# EAGLE schematic uC_Board (EAGLE 7.1.0)
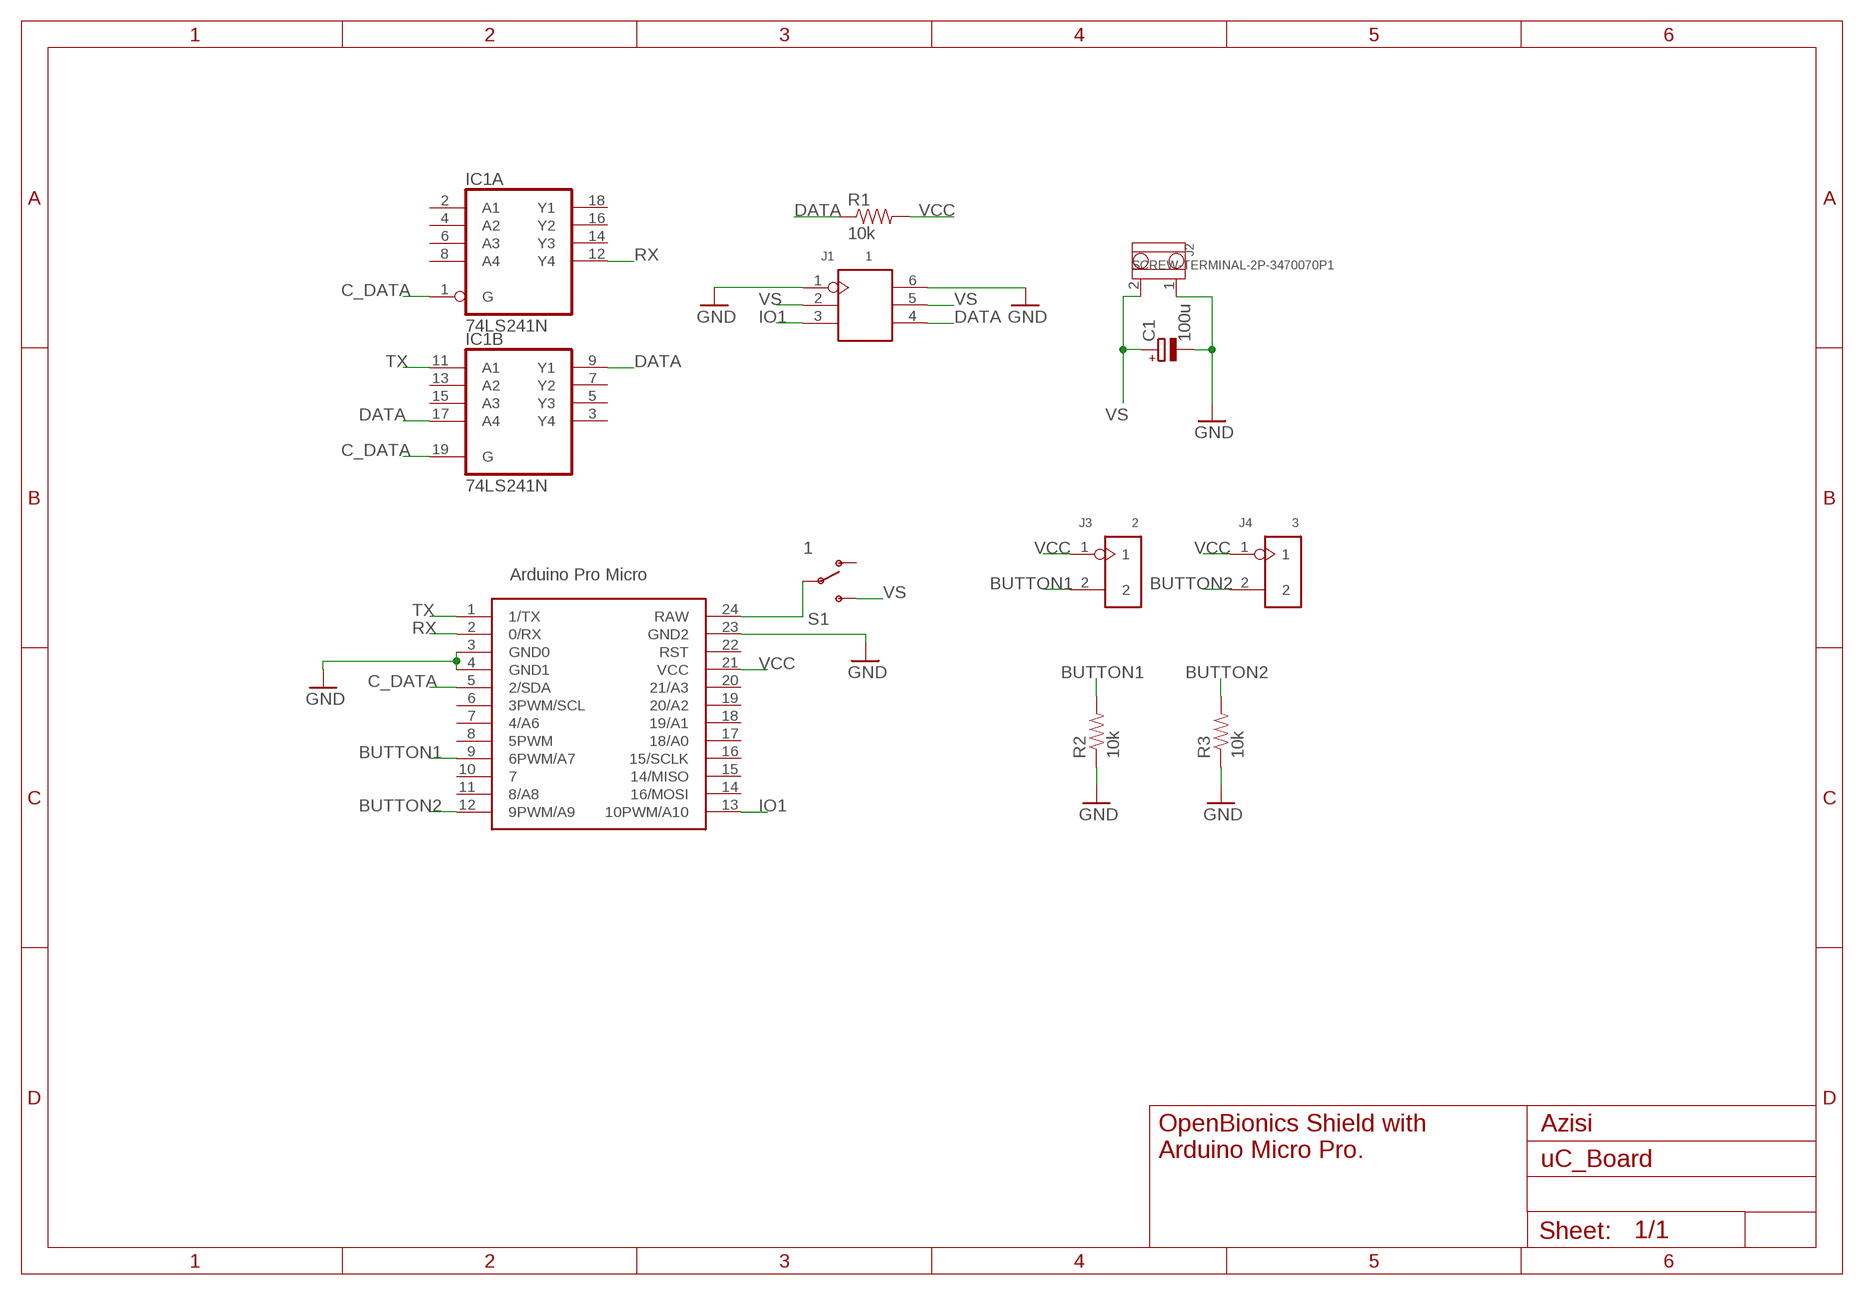
[diagram p0: schematic, sheet 1]

## Parts
ARDUINO_MICRO  ARDUINO_PRO_MICROARDUINO_BOARD  [ARDUINO_MICRO_PRO]
C1  100u  CPOL-EUE2.5-6  [E2,5-6]
IC1  74LS241N  [DIL20]
J1  1  HEADER-2X3P-2.54  [2X3P-2.54-65/35MIL]
J2  SCREW-TERMINAL-2P-3470070P1  [2P-3.5]
J3  2  HEADER-2P-65/35MIL  [2P-2.54-65/35MIL]
J4  3  HEADER-2P-65/35MIL  [2P-2.54-65/35MIL]
R1  10k  RESISTOR1206  [1206]
R2  10k  RESISTOR1206  [1206]
R3  10k  RESISTOR1206  [1206]
S1  1  SWITCH-SPDTSMD2  [SWITCH-SPDT-SMD]

## Nets
BUTTON1: ARDUINO_MICRO.9(6PWM/A7) J3.2 R2.2
BUTTON2: ARDUINO_MICRO.12(9PWM/A9) J4.2 R3.2
C_DATA: ARDUINO_MICRO.5(2/SDA) IC1.1(A:G) IC1.19(B:G)
DATA: IC1.9(B:Y1) IC1.17(B:A4) J1.4 R1.1
GND: ARDUINO_MICRO.3(GND0) ARDUINO_MICRO.4(GND1) ARDUINO_MICRO.23(GND2) C1.- J1.1 J1.6 J2.1 R2.1 R3.1
IO1: ARDUINO_MICRO.13(10PWM/A10) J1.3
N$1: ARDUINO_MICRO.24(RAW) S1.2(P)
RX: ARDUINO_MICRO.2(0/RX) IC1.12(A:Y4)
TX: ARDUINO_MICRO.1(1/TX) IC1.11(B:A1)
VCC: ARDUINO_MICRO.21(VCC) J3.1 J4.1 R1.2
VS: C1.+ J1.2 J1.5 J2.2 S1.3(S)
Unconnected: ARDUINO_MICRO.6(3PWM/SCL) ARDUINO_MICRO.7(4/A6) ARDUINO_MICRO.8(5PWM) ARDUINO_MICRO.10 ARDUINO_MICRO.11(8/A8) ARDUINO_MICRO.14(16/MOSI) ARDUINO_MICRO.15(14/MISO) ARDUINO_MICRO.16(15/SCLK) ARDUINO_MICRO.17(18/A0) ARDUINO_MICRO.18(19/A1) ARDUINO_MICRO.19(20/A2) ARDUINO_MICRO.20(21/A3) ARDUINO_MICRO.22(RST) IC1.2(A:A1) IC1.3(B:Y4) IC1.4(A:A2) IC1.5(B:Y3) IC1.6(A:A3) IC1.7(B:Y2) IC1.8(A:A4) IC1.13(B:A2) IC1.14(A:Y3) IC1.15(B:A3) IC1.16(A:Y2) IC1.18(A:Y1) S1.1(O)

## Notes on the sheet
- Azisi
- OpenBionics Shield with
  Arduino Micro Pro.

## Power pins joined to a net without a drawn wire
GND: IC1.10(P:GND)
VCC: IC1.20(P:VCC)

## Library data of the parts
ARDUINO_MICRO = OpenBionics:ARDUINO_PRO_MICRO: Breakout Board for arduino micro pro.
C1 = rcl:CPOL-EU: POLARIZED CAPACITOR, European symbol
IC1 = 74xx-eu:74*241: Octal BUFFER and LINE DRIVER, 3-state
J1 = Connector:HEADER-2X3P
J2 = Connector:SCREW-TERMINAL-2P
J3 J4 = Connector:HEADER-2P
R1-R3 = SparkFun-Passives:RESISTOR: Resistor Basic schematic elements and footprints for 0603, 1206, and PTH resistors.
S1 = SparkFun-Electromechanical:SWITCH-SPDT: SPDT Switch Simple slide switch, Spark Fun Electronics SKU : COM-00102 DPDT SMT slide switch, AYZ0202, SWCH-08179